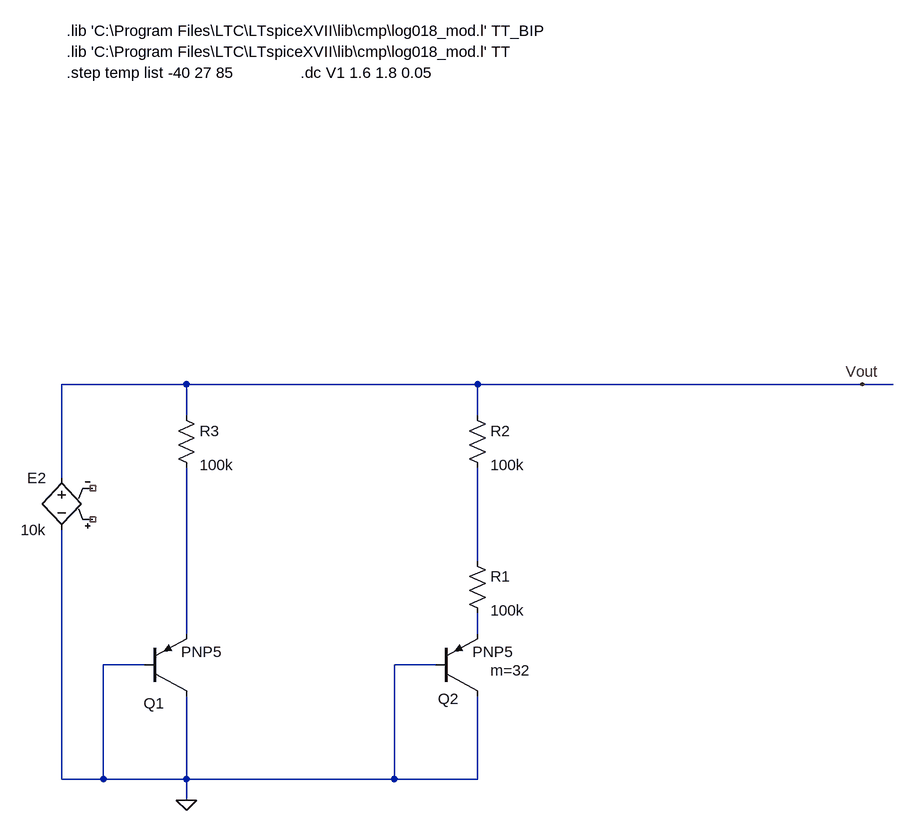
[diagram p0: schematic SPICE_RESIT.asc]
SPICE_RESIT.asc, the LTspice schematic file:
Version 4
SHEET 1 2248 1144
WIRE 400 0 208 0
WIRE 848 0 400 0
WIRE 1440 0 848 0
WIRE 1488 0 1440 0
WIRE 400 48 400 0
WIRE 848 48 848 0
WIRE 208 144 208 0
WIRE 848 272 848 128
WIRE 400 384 400 128
WIRE 848 384 848 352
WIRE 336 432 272 432
WIRE 784 432 720 432
WIRE 208 608 208 224
WIRE 272 608 272 432
WIRE 272 608 208 608
WIRE 400 608 400 480
WIRE 400 608 272 608
WIRE 720 608 720 432
WIRE 720 608 400 608
WIRE 848 608 848 480
WIRE 848 608 720 608
WIRE 400 640 400 608
FLAG 400 640 0
FLAG 1440 0 Vout
SYMBOL pnp2 336 480 M180
WINDOW 0 -2 -11 Left 2
SYMATTR InstName Q1
SYMATTR Value PNP5
SYMBOL pnp2 784 480 M180
WINDOW 123 84 40 Left 2
WINDOW 0 3 -4 Left 2
SYMATTR Value2 m=32
SYMATTR InstName Q2
SYMATTR Value PNP5
SYMBOL res 832 256 R0
WINDOW 3 36 92 Left 2
SYMATTR Value 100k
SYMATTR InstName R1
SYMBOL e2 208 128 M0
SYMATTR InstName E2
SYMATTR Value 10k
SYMBOL res 832 32 R0
WINDOW 3 36 92 Left 2
SYMATTR Value 100k
SYMATTR InstName R2
SYMBOL res 384 32 R0
WINDOW 3 36 92 Left 2
SYMATTR Value 100k
SYMATTR InstName R3
TEXT 216 -480 Left 2 !.step temp list -40 27 85
TEXT 216 -512 Left 2 !.lib 'C:\\Program Files\\LTC\\LTspiceXVII\\lib\\cmp\\log018_mod.l' TT
TEXT 216 -544 Left 2 !.lib 'C:\\Program Files\\LTC\\LTspiceXVII\\lib\\cmp\\log018_mod.l' TT_BIP
TEXT 576 -480 Left 2 !.dc V1 1.6 1.8 0.05

The netlist it stands for:
* SPICE_RESIT.asc
Q1 0 0 N002 0 PNP5
Q2 0 0 N003 0 PNP5 m=32
R1 N001 N003 100k
E2 Vout 0 NC_01 NC_02 10k
R2 Vout N001 100k
R3 Vout N002 100k
.model NPN NPN
.model PNP PNP
.lib standard.bjt
.step temp list -40 27 85
.lib 'C:\Program Files\LTC\LTspiceXVII\lib\cmp\log018_mod.l' TT
.lib 'C:\Program Files\LTC\LTspiceXVII\lib\cmp\log018_mod.l' TT_BIP
.dc V1 1.6 1.8 0.05
.backanno
.end